# Altium schematic sheet 06_rc_cap.SchDoc: =Proj_Title
size B; Address1: Giesshuebelstrasse 40; Address2: 8045 Zurich, Switzerland; SheetNumber: 6
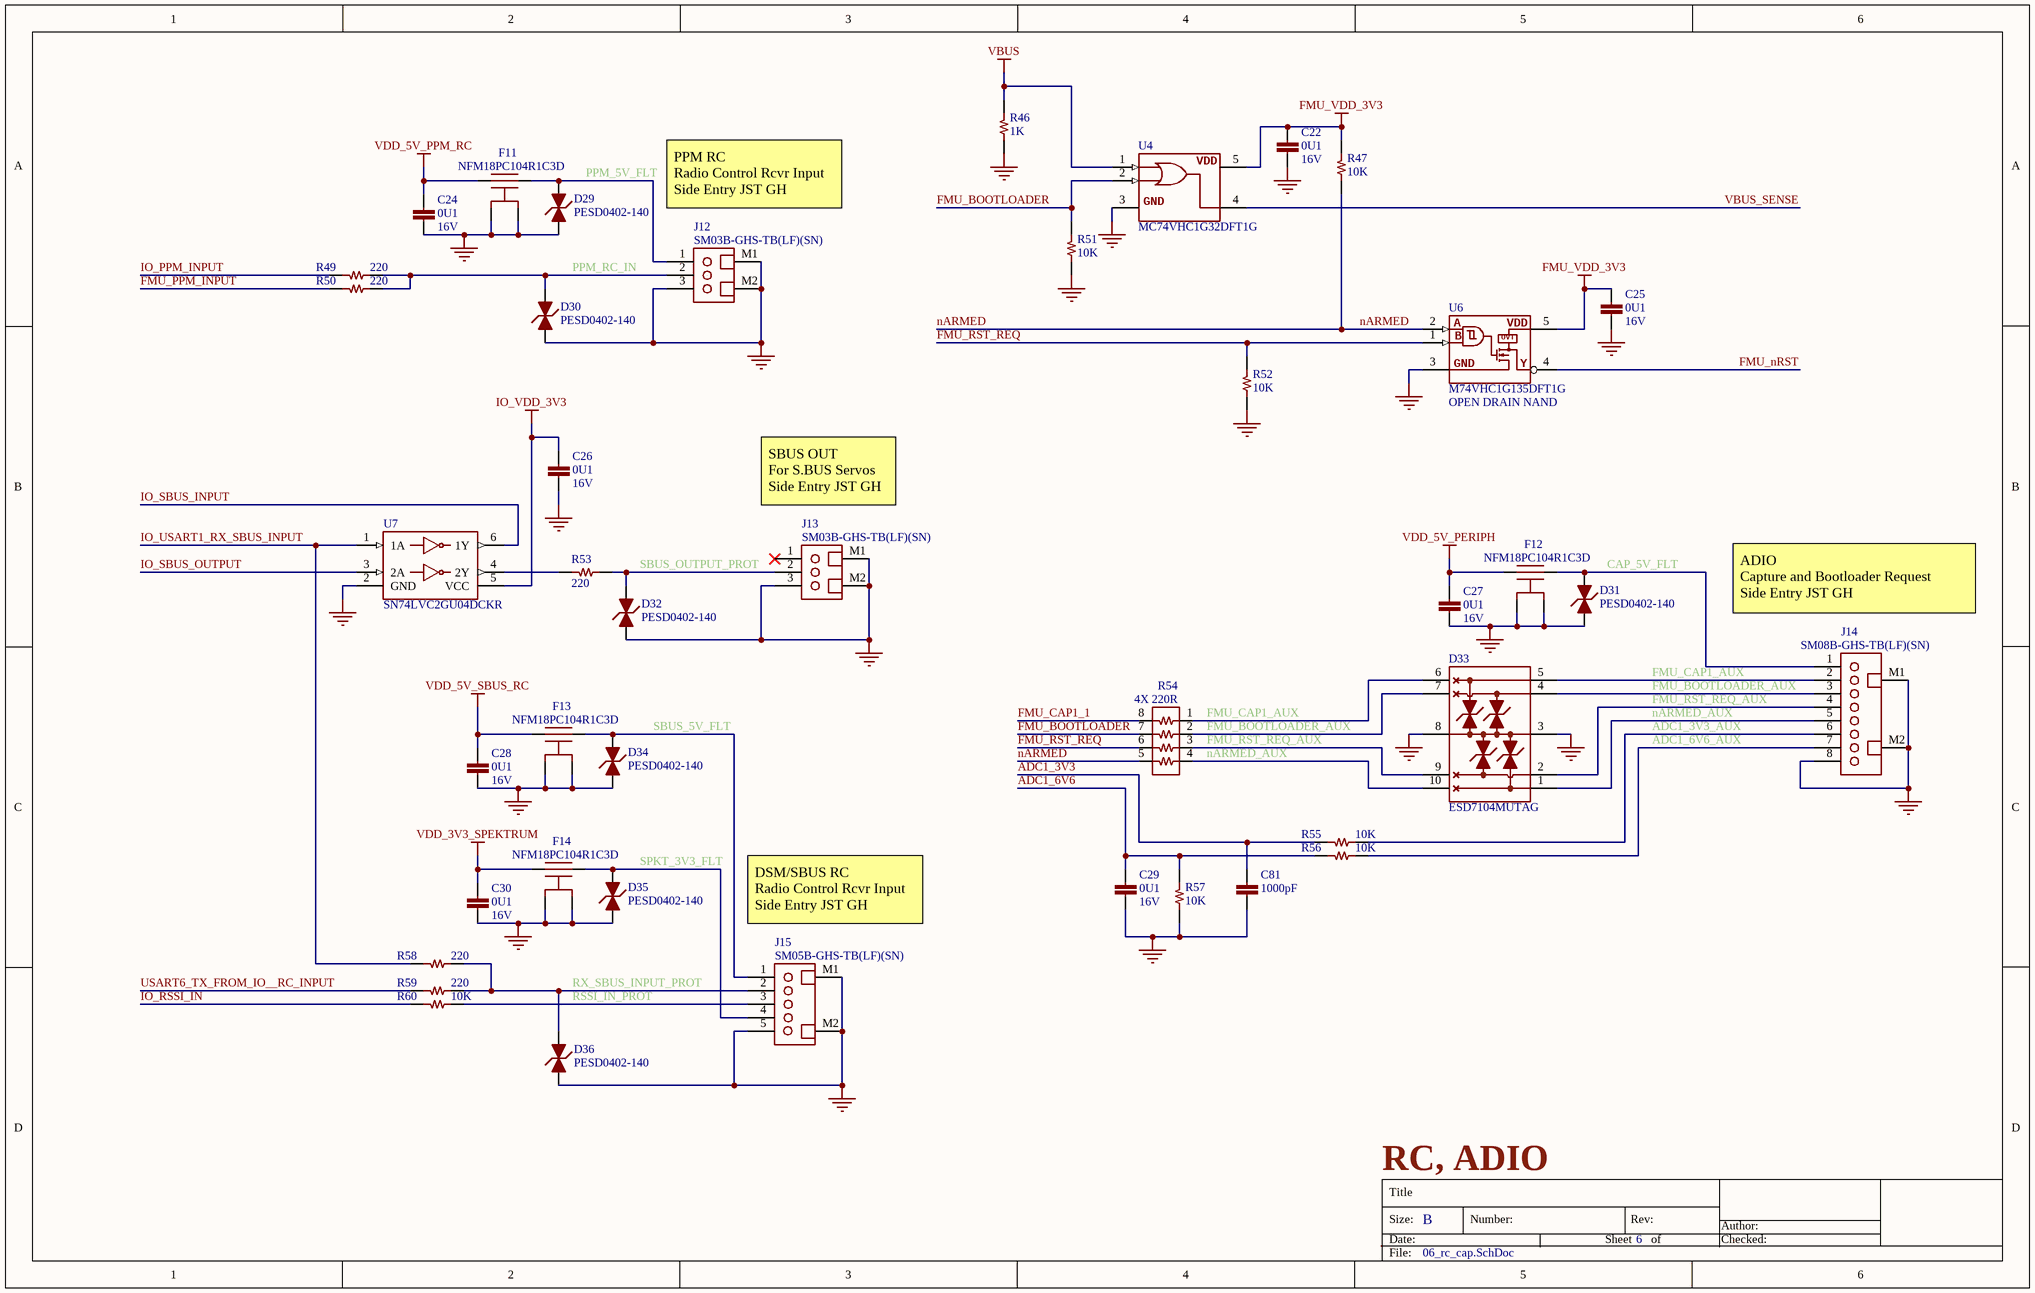
[diagram p0: 06_rc_cap.SchDoc]

## Parts
C22  value 0U1  Voltage - Rated: 16V  [CAPC100X50X56L25N]  (hidden comment: CAP CER 0.1UF 10% 16V X7R 0402)
C24  value 0U1  Voltage - Rated: 16V  [CAPC100X50X56L25N]  (hidden comment: CAP CER 0.1UF 10% 16V X7R 0402)
C25  value 0U1  Voltage - Rated: 16V  [CAPC100X50X56L25N]  (hidden comment: CAP CER 0.1UF 10% 16V X7R 0402)
C26  value 0U1  Voltage - Rated: 16V  [CAPC100X50X56L25N]  (hidden comment: CAP CER 0.1UF 10% 16V X7R 0402)
C27  value 0U1  Voltage - Rated: 16V  [CAPC100X50X56L25N]  (hidden comment: CAP CER 0.1UF 10% 16V X7R 0402)
C28  value 0U1  Voltage - Rated: 16V  [CAPC100X50X56L25N]  (hidden comment: CAP CER 0.1UF 10% 16V X7R 0402)
C29  value 0U1  Voltage - Rated: 16V  [CAPC100X50X56L25N]  (hidden comment: CAP CER 0.1UF 10% 16V X7R 0402)
C30  value 0U1  Voltage - Rated: 16V  [CAPC100X50X56L25N]  (hidden comment: CAP CER 0.1UF 10% 16V X7R 0402)
C81  value 1000pF  [CAPC100X50X56L25N]  (hidden comment: CAP CER 1000PF 10% 50V X7R 0402)
D29  Manufacturer Part Number: PESD0402-140  [DIONC100X50X43L20N]  (hidden comment: DIODE TVS BIDIRECTIONAL 14VWM 40VC 0402)
D30  Manufacturer Part Number: PESD0402-140  [DIONC100X50X43L20N]  (hidden comment: DIODE TVS BIDIRECTIONAL 14VWM 40VC 0402)
D31  Manufacturer Part Number: PESD0402-140  [DIONC100X50X43L20N]  (hidden comment: DIODE TVS BIDIRECTIONAL 14VWM 40VC 0402)
D32  Manufacturer Part Number: PESD0402-140  [DIONC100X50X43L20N]  (hidden comment: DIODE TVS BIDIRECTIONAL 14VWM 40VC 0402)
D33  Manufacturer Part Number: ESD7104MUTAG  [UDFN10P50_250X100X55L35X20N]  (hidden comment: DIODE TVS BIDIRECTIONAL 5V 10V 10UDFN)
D34  Manufacturer Part Number: PESD0402-140  [DIONC100X50X43L20N]  (hidden comment: DIODE TVS BIDIRECTIONAL 14VWM 40VC 0402)
D35  Manufacturer Part Number: PESD0402-140  [DIONC100X50X43L20N]  (hidden comment: DIODE TVS BIDIRECTIONAL 14VWM 40VC 0402)
D36  Manufacturer Part Number: PESD0402-140  [DIONC100X50X43L20N]  (hidden comment: DIODE TVS BIDIRECTIONAL 14VWM 40VC 0402)
F11  Manufacturer Part Number: NFM18PC104R1C3D  [NFM18PC104R1C3_0603_NO_VIA]  (hidden comment: FILTER CAP FEEDTHRU 0.1UF 20% 16V 0603)
F12  Manufacturer Part Number: NFM18PC104R1C3D  [NFM18PC104R1C3_0603_NO_VIA]  (hidden comment: FILTER CAP FEEDTHRU 0.1UF 20% 16V 0603)
F13  Manufacturer Part Number: NFM18PC104R1C3D  [NFM18PC104R1C3_0603_NO_VIA]  (hidden comment: FILTER CAP FEEDTHRU 0.1UF 20% 16V 0603)
F14  Manufacturer Part Number: NFM18PC104R1C3D  [NFM18PC104R1C3_0603_NO_VIA]  (hidden comment: FILTER CAP FEEDTHRU 0.1UF 20% 16V 0603)
J12  Manufacturer Part Number: SM03B-GHS-TB(LF)(SN)  [JST_SM03B-GHS-TBLFSN]  (hidden comment: CONN HEADER GH SIDE 3POS 1.25MM)
J13  Manufacturer Part Number: SM03B-GHS-TB(LF)(SN)  [JST_SM03B-GHS-TBLFSN]  (hidden comment: CONN HEADER GH SIDE 3POS 1.25MM)
J14  Manufacturer Part Number: SM08B-GHS-TB(LF)(SN)  [JST_SM08B-GHS-TBLFSN]  (hidden comment: CONN HEADER GH 8POS SIDE 1.25MM SMT)
J15  Manufacturer Part Number: SM05B-GHS-TB(LF)(SN)  [JST_SM05B-GHS-TBLFSN]  (hidden comment: CONN HEADER GH SIDE 5POS 1.25MM SMT)
R46  value 1K  [RESC100X50X40L25]  (hidden comment: RES SMD 1K OHM 1% 1/16W 0402)
R47  value 10K  [RESC100X50X40L25]  (hidden comment: RES SMD 10K OHM 1% 1/16W 0402)
R49  value 220  [RESC100X50X40L25]  (hidden comment: RES SMD 220 OHM 1% 1/16W 0402)
R50  value 220  [RESC100X50X40L25]  (hidden comment: RES SMD 220 OHM 1% 1/16W 0402)
R51  value 10K  [RESC100X50X40L25]  (hidden comment: RES SMD 10K OHM 1% 1/16W 0402)
R52  value 10K  [RESC100X50X40L25]  (hidden comment: RES SMD 10K OHM 1% 1/16W 0402)
R53  value 220  [RESC100X50X40L25]  (hidden comment: RES SMD 220 OHM 1% 1/16W 0402)
R54  value 4X 220R  [RESCAF8P80_320X160X61L30X65N]  (hidden comment: RES ARRAY 4 RES 220 OHM 1206)
R55  value 10K  [RESC100X50X40L25]  (hidden comment: RES SMD 10K OHM 1% 1/16W 0402)
R56  value 10K  [RESC100X50X40L25]  (hidden comment: RES SMD 10K OHM 1% 1/16W 0402)
R57  value 10K  [RESC100X50X40L25]  (hidden comment: RES SMD 10K OHM 1% 1/16W 0402)
R58  value 220  [RESC100X50X40L25]  (hidden comment: RES SMD 220 OHM 1% 1/16W 0402)
R59  value 220  [RESC100X50X40L25]  (hidden comment: RES SMD 220 OHM 1% 1/16W 0402)
R60  value 10K  [RESC100X50X40L25]  (hidden comment: RES SMD 10K OHM 1% 1/16W 0402)
U4  Manufacturer Part Number: MC74VHC1G32DFT1G  [SOT23-5P65_210X110L36X22N]  (hidden comment: IC GATE OR 1CH 2-INP SC88A)
U6  Manufacturer Part Number: M74VHC1G135DFT1G  ID: OPEN DRAIN NAND  [SOT23-5P65_210X110L20X20]  (hidden comment: IC GATE NAND SCHMITT OPEN DRAIN 1CH 2-INP SC88A)
U7  Manufacturer Part Number: SN74LVC2GU04DCKR  [SOT23-6P65_210X110L36X22N]  (hidden comment: IC DUAL INV  SC70-6)

## Nets
FMU_VDD_3V3: C22.1 C25.1 R47.1 U4.5(VDD) U6.5(VDD)
GND: C22.2 C24.2 C25.2 C26.2 C27.2 C28.2 C29.2 C30.2 C81.2 D29.1 D30.1 D31.1 D32.1 D33.3(GND) D33.8(GND) D34.1 D35.1 D36.1 F11.2A(GND) F11.2B(GND) F12.2A(GND) F12.2B(GND) F13.2A(GND) F13.2B(GND) F14.2A(GND) F14.2B(GND) J12.3 J12.M1 J12.M2 J13.3 J13.M1 J13.M2 J14.8 J14.M1 J14.M2 J15.5 J15.M1 J15.M2 R46.2 R51.2 R52.2 R57.2 U4.3(GND) U6.3(GND) U7.2(GND)
IO_VDD_3V3: C26.1 U7.5(VCC)
VBUS: R46.1 U4.1(B)
VDD_3V3_SPEKTRUM: C30.1 F14.1
VDD_5V_PERIPH: C27.1 F12.1
VDD_5V_PPM_RC: C24.1 F11.1
VDD_5V_SBUS_RC: C28.1 F13.1
ADC1_3V3: C81.1 R55.1
ADC1_3V3_AUX: J14.6 R55.2
ADC1_6V6: C29.1 R56.1 R57.1
ADC1_6V6_AUX: J14.7 R56.2
CAP_5V_FLT: D31.2 F12.3 J14.1
FMU_BOOTLOADER: R51.1 R54.7 U4.2(A)
FMU_BOOTLOADER_AUX: D33.4 D33.7(NC) J14.3 R54.2
FMU_CAP1_1: R54.8
FMU_CAP1_AUX: D33.5 D33.6(NC) J14.2 R54.1
FMU_nRST: U6.4(Y)
FMU_PPM_INPUT: R50.1
FMU_RST_REQ: R52.1 R54.6 U6.1(B)
FMU_RST_REQ_AUX: D33.2 D33.9(NC) J14.4 R54.3
IO_PPM_INPUT: R49.1
IO_RSSI_IN: R60.1
IO_SBUS_INPUT: U7.6(1Y)
IO_SBUS_OUTPUT: U7.3(2A)
IO_USART1_RX_SBUS_INPUT: R58.1 U7.1(1A)
nARMED: R47.2 R54.5 U6.2(A)
nARMED_AUX: D33.1 D33.10(NC) J14.5 R54.4
PPM_5V_FLT: D29.2 F11.3 J12.1
PPM_RC_IN: D30.2 J12.2 R49.2 R50.2
RSSI_IN_PROT: J15.3 R60.2
RX_SBUS_INPUT_PROT: D36.2 J15.2 R58.2 R59.2
SBUS_5V_FLT: D34.2 F13.3 J15.1
SBUS_OUTPUT_PROT: D32.2 J13.2 R53.2
SPKT_3V3_FLT: D35.2 F14.3 J15.4
USART6_TX_FROM_IO__RC_INPUT: R59.1
VBUS_SENSE: U4.4(Y)
NetR53_1: R53.1 U7.4(2Y)

Not connected (* = marked no-connect by the designer): J13 1*

## Notes on the sheet
- PPM RC
  Radio Control Rcvr Input
  Side Entry JST GH
- SBUS OUT
  For S.BUS Servos
  Side Entry JST GH
- ADIO
  Capture and Bootloader Request
  Side Entry JST GH
- DSM/SBUS RC
  Radio Control Rcvr Input
  Side Entry JST GH
- RC, ADIO
- Title
- Size:
- Date:
- B
- Number:
- Sheet
- Rev:
- of
- Author:
- Checked:
- File:
- (in symbol IC_GATE_SINGLE_NAND_SCHMITT_OPEN_DRAIN) OVT

## Library data of the parts
C22 C24-C30 = CAP_0U1_16V_X7R_0402: Manufacturer: Murata Electronics; Manufacturer Part Number: GCM155R71C104KA55J; Packaging: Cut Tape (CT); Part Status: Active; Tolerance: ±10%; Operating Temperature: -55°C ~ 125°C; Supplier 1: Digi-Key; Supplier Part Number 1: 490-7998-1-ND; Category: Capacitors; Stock 1: 6381653; Pricing 1: 1=0.1, 10=0.049, 100=0.022, 500=0.0157, 1000=0.01233, 2500=0.01121, 5000=0.01032 (USD); ComponentLink1Description: https://www.digikey.com/product-detail/en/murata-electronics/GCM155R71C104KA55J/490-7998-1-ND/4380283; ComponentLink1URL: https://www.digikey.com/product-detail/en/murata-electronics/GCM155R71C104KA55J/490-7998-1-ND/4380283
C81 = CAP_1000PF_10%_50V_X7R_0402: Manufacturer: Murata Electronics North America; Manufacturer Part Number: GCM155R71H102KA37D; Packaging: Cut Tape (CT); Part Status: Active; Operating Temperature: -55°C ~ 125°C; Supplier 1: Digi-Key; Supplier Part Number 1: 490-4761-1-ND; Category: Capacitors; Stock 1: 100000; Pricing 1: 1=0.1, 10=0.02, 100=0.0091, 500=0.0065, 1000=0.00511, 2500=0.00465, 5000=0.00428 (USD); Voltage - Rated: 50V; ComponentLink1Description: https://www.digikey.com/product-detail/en/murata-electronics-north-america/GCM155R71H102KA37D/490-4761-1-ND/1641680; ComponentLink1URL: https://www.digikey.com/product-detail/en/murata-electronics-north-america/GCM155R71H102KA37D/490-4761-1-ND/1641680; Tolerance: ±10%
D29-D32 D34-D36 = DIODE_TVS_0402: Manufacturer: Littelfuse Inc.; Packaging: Cut Tape (CT); Part Status: Active; Operating Temperature: -55°C ~ 125°C (TJ); ComponentLink1URL: https://www.digikey.com/products/en/circuit-protection/tvs-diodes/144?k=PESD0402-140&k=&pkeyword=PESD0402-140&pv7=2&sf=0&quantity=&ColumnSort=0&page=1&pageSize=25; ComponentLink1Description: https://www.digikey.com/products/en/circuit-protection/tvs-diodes/144?k=PESD0402-140&k=&pkeyword=PESD0402-140&pv7=2&sf=0&quantity=&ColumnSort=0&page=1&pageSize=25; Supplier 1: Digi-Key; Supplier Part Number 1: PESD0402-140CT-ND; Category: Circuit Protection; Stock 1: 281442; Pricing 1: 10000=0.13154, 30000=0.12096 (USD)
D33 = DIODE_TVS_4X_10UDFN: Manufacturer: ON Semiconductor; Packaging: Cut Tape (CT); Part Status: Active; Operating Temperature: -55°C ~ 125°C (TJ); Supplier 1: Digi-Key; Supplier Part Number 1: ESD7104MUTAGOSCT-ND; Category: Circuit Protection; Stock 1: 5750; Pricing 1: 1=0.63, 10=0.541, 100=0.40370, 500=0.31716, 1000=0.24508 (USD); ComponentLink1Description: https://www.digikey.com/product-detail/en/on-semiconductor/ESD7104MUTAG/ESD7104MUTAGOSCT-ND/3487538; ComponentLink1URL: https://www.digikey.com/product-detail/en/on-semiconductor/ESD7104MUTAG/ESD7104MUTAGOSCT-ND/3487538
F11-F14 = FILTER_0.1uF_16V_2A_NO_VIA_0603: Manufacturer: Murata Electronics North America; Packaging: Cut Tape (CT); Part Status: Active; Tolerance: ±20%; Voltage - Rated: 16V; Operating Temperature: -55°C ~ 125°C; Supplier 1: Digi-Key; Supplier Part Number 1: 490-6969-1-ND; Category: Filters; Stock 1: 172860; Pricing 1: 1=0.19, 10=0.173, 25=0.1652, 50=0.1598, 100=0.1544, 250=0.1464, 500=0.12246, 1000=0.09503 (USD); ComponentLink1Description: https://www.digikey.com/products/en/filters/feed-through-capacitors/845?k=NFM18PC104R1C3D&k=&pkeyword=NFM18PC104R1C3D&pv7=2&sf=0&quantity=&ColumnSort=0&page=1&pageSize=25; ComponentLink1URL: https://www.digikey.com/products/en/filters/feed-through-capacitors/845?k=NFM18PC104R1C3D&k=&pkeyword=NFM18PC104R1C3D&pv7=2&sf=0&quantity=&ColumnSort=0&page=1&pageSize=25
J12 J13 = CONN_JST_GH_3PIN_RA_SMT: Manufacturer: JST Sales America Inc.; Voltage - Rated: 50V; System: Connector; Packaging: Cut Tape (CT); Part Status: Active; Operating Temperature: -25°C ~ 85°C; Supplier 1: Digi-Key; Category: Connectors, Interconnects; Stock 1: 3338; Pricing 1: 1=0.44, 10=0.413, 100=0.316, 500=0.27502, 1000=0.22689 (USD); Supplier Part Number 1: 455-1565-1-ND; ComponentLink1Description: https://www.digikey.com/products/en/connectors-interconnects/rectangular-connectors-headers-male-pins/314?k=sm03b-gh&k=&pkeyword=sm03b-gh&pv7=2&sf=0&quantity=&ColumnSort=0&page=1&pageSize=25; ComponentLink1URL: https://www.digikey.com/products/en/connectors-interconnects/rectangular-connectors-headers-male-pins/314?k=sm03b-gh&k=&pkeyword=sm03b-gh&pv7=2&sf=0&quantity=&ColumnSort=0&page=1&pageSize=25
J14 = CONN_JST_GH_8PIN_RA_SMT: Manufacturer: JST Sales America Inc.; Voltage - Rated: 50V; System: Connector; Packaging: Cut Tape (CT); Part Status: Active; Operating Temperature: -25°C ~ 85°C; Supplier 1: Digi-Key; Supplier Part Number 1: 455-1570-1-ND; Category: Connectors, Interconnects; Stock 1: 90523; Pricing 1: 1=0.59, 10=0.549, 100=0.4208, 500=0.36594, 1000=0.30191 (USD); ComponentLink1Description: https://www.digikey.com/products/en/connectors-interconnects/rectangular-connectors-headers-male-pins/314?k=sm08b-GHS&k=&pkeyword=sm08b-GHS&sv=0&pv7=2&sf=0&quantity=&ColumnSort=0&page=1&pageSize=25; ComponentLink1URL: https://www.digikey.com/products/en/connectors-interconnects/rectangular-connectors-headers-male-pins/314?k=sm08b-GHS&k=&pkeyword=sm08b-GHS&sv=0&pv7=2&sf=0&quantity=&ColumnSort=0&page=1&pageSize=25
J15 = CONN_JST_GH_5PIN_RA_SMT: Manufacturer: JST Sales America Inc.; Voltage - Rated: 50V; System: Connector; Packaging: Cut Tape (CT); Part Status: Active; Operating Temperature: -25°C ~ 85°C; Supplier 1: Digi-Key; Supplier Part Number 1: 455-1567-1-ND; Category: Connectors, Interconnects; Stock 1: 32934; Pricing 1: 1=0.44, 10=0.413, 100=0.3163, 500=0.27502, 1000=0.22689 (USD); ComponentLink1Description: https://www.digikey.com/products/en/connectors-interconnects/rectangular-connectors-headers-male-pins/314?k=sm05b-gh&k=&pkeyword=sm05b-gh&pv7=2&sf=0&quantity=&ColumnSort=0&page=1&pageSize=25; ComponentLink1URL: https://www.digikey.com/products/en/connectors-interconnects/rectangular-connectors-headers-male-pins/314?k=sm05b-gh&k=&pkeyword=sm05b-gh&pv7=2&sf=0&quantity=&ColumnSort=0&page=1&pageSize=25
R46 = RES_1K_1%_1/16W_0402: Manufacturer: Yageo; Manufacturer Part Number: RC0402FR-071KL; Packaging: Cut Tape (CT); Part Status: Active; Tolerance: ±1%; Operating Temperature: -55°C ~ 155°C; Supplier 1: Digi-Key; Supplier Part Number 1: 311-1.00KLRCT-ND; Category: Resistors; Stock 1: 18685853; Pricing 1: 1=0.1, 10=0.014, 100=0.0056, 1000=0.00253, 2500=0.0022, 5000=0.00181 (USD); Power: 1/16W; ComponentLink1Description: https://www.digikey.com/product-detail/en/yageo/RC0402FR-071KL/311-1.00KLRCT-ND/729460; ComponentLink1URL: https://www.digikey.com/product-detail/en/yageo/RC0402FR-071KL/311-1.00KLRCT-ND/729460
R47 R51 R52 R55-R57 R60 = RES_10K_1%_1/16W_0402: Manufacturer: Vishay Dale; Manufacturer Part Number: CRCW040210K0FKED; Packaging: Cut Tape (CT); Part Status: Active; Tolerance: ±1%; Operating Temperature: -55°C ~ 155°C; Supplier 1: Digi-Key; Supplier Part Number 1: 541-10.0KLCT-ND; Category: Resistors; Stock 1: 37996194; Pricing 1: 1=0.1, 10=0.014, 100=0.0056, 1000=0.00253, 2500=0.0022, 5000=0.00181 (USD); Power: 1/16W; ComponentLink1Description: https://www.digikey.com/products/en?keywords=311-10.0KLRCT-ND; ComponentLink1URL: https://www.digikey.com/products/en?keywords=311-10.0KLRCT-ND
R49 R50 R53 R58 R59 = RES_220_1%_1/16W_0402: Manufacturer: Yageo; Manufacturer Part Number: RC0402FR-07220RL; Category: Resistors; Packaging: Cut Tape (CT); Part Status: Active; Tolerance: ±1%; Power: 1/16W; Operating Temperature: -55°C ~ 155°C; ComponentLink1URL: https://www.digikey.com/products/en/resistors/chip-resistor-surface-mount/52?k=RC0402FR-07220RL&k=&pkeyword=RC0402FR-07220RL&pv7=2&sf=0&quantity=&ColumnSort=0&page=1&pageSize=25; ComponentLink1Description: https://www.digikey.com/products/en/resistors/chip-resistor-surface-mount/52?k=RC0402FR-07220RL&k=&pkeyword=RC0402FR-07220RL&pv7=2&sf=0&quantity=&ColumnSort=0&page=1&pageSize=25; Supplier 1: Digi-Key; Supplier Part Number 1: 311-220LRCT-ND; Stock 1: 897942; Pricing 1: 1=0.1, 10=0.014, 100=0.0056, 1000=0.00253, 2500=0.0022, 5000=0.00181 (USD)
R54 = RES_ARRAY_220_5%_1/16W_1206: Manufacturer: Yageo; Manufacturer Part Number: YC164-JR-07220RL; Tolerance: ±5%; Power: 1/16W; Packaging: Cut Tape (CT); Part Status: Active; Operating Temperature: -55°C ~ 155°C; Supplier 1: Digi-Key; Supplier Part Number 1: YC164J-220CT-ND; Category: Resistors; Stock 1: 17927; Pricing 1: 1=0.1, 10=0.014, 100=0.0056, 1000=0.00253, 2500=0.0022, 5000=0.00181 (USD); ComponentLink1Description: https://www.digikey.com/products/en/resistors/resistor-networks-arrays/50?k=&pkeyword=&pv16=9574&sf=0&FV=fffc000d%2C1c0002%2C1f140000%2C24280001%2Cffe00032%2C40136&quantity=&ColumnSort=0&page=1&pageSize=25; ComponentLink1URL: https://www.digikey.com/products/en/resistors/resistor-networks-arrays/50?k=&pkeyword=&pv16=9574&sf=0&FV=fffc000d%2C1c0002%2C1f140000%2C24280001%2Cffe00032%2C40136&quantity=&ColumnSort=0&page=1&pageSize=25
U4 = IC_GATE_SINGLE_OR_SC88A: Manufacturer: ON Semiconductor; Packaging: Cut Tape (CT); Part Status: Active; Operating Temperature: -55°C ~ 125°C; Supplier 1: Digi-Key; Supplier Part Number 1: MC74VHC1G32DFT1GOSCT-ND; Category: Integrated Circuits (ICs); Stock 1: 5437; Pricing 1: 1=0.31 (USD); ComponentLink1Description: https://www.digikey.com/product-detail/en/on-semiconductor/MC74VHC1G32DFT1G/MC74VHC1G32DFT1GOSCT-ND/1967119; ComponentLink1URL: https://www.digikey.com/product-detail/en/on-semiconductor/MC74VHC1G32DFT1G/MC74VHC1G32DFT1GOSCT-ND/1967119
U6 = IC_GATE_SINGLE_NAND_SCHMITT_OPEN_DRAIN: Manufacturer: ON Semiconductor; Packaging: Cut Tape (CT); Part Status: Active; Operating Temperature: -55°C ~ 125°C; Supplier 1: Digi-Key; Supplier Part Number 1: M74VHC1G135DFT1GOSDKR-ND; Category: Integrated Circuits (ICs); Stock 1: 57000; Pricing 1: 1=0.34, 10=0.28, 100=0.1485, 500=0.09772, 1000=0.06645 (USD); ComponentLink1Description: https://www.digikey.com/product-detail/en/on-semiconductor/M74VHC1G135DFT1G/M74VHC1G135DFT1GOSDKR-ND/4331868; ComponentLink1URL: https://www.digikey.com/product-detail/en/on-semiconductor/M74VHC1G135DFT1G/M74VHC1G135DFT1GOSDKR-ND/4331868
U7 = IC_GATE_DUAL_INV_SC70-6: Manufacturer: Texas Instruments; Category: Integrated Circuits (ICs); Min Operating Temperature: -40°C; Max Operating Temperature: 125°C; Packaging: Cut Tape (CT); Pricing 1: 1=0.61, 10=0.521, 100=0.3893, 500=0.30592, 1000=0.23639 (USD); Stock 1: 44331; Supplier 1: Digi-Key; Supplier Part Number 1: 296-13277-1-ND; ComponentLink1Description: https://www.digikey.com/product-detail/en/texas-instruments/SN74LVC2GU04DCKR/296-13277-1-ND/484490; ComponentLink1URL: https://www.digikey.com/product-detail/en/texas-instruments/SN74LVC2GU04DCKR/296-13277-1-ND/484490